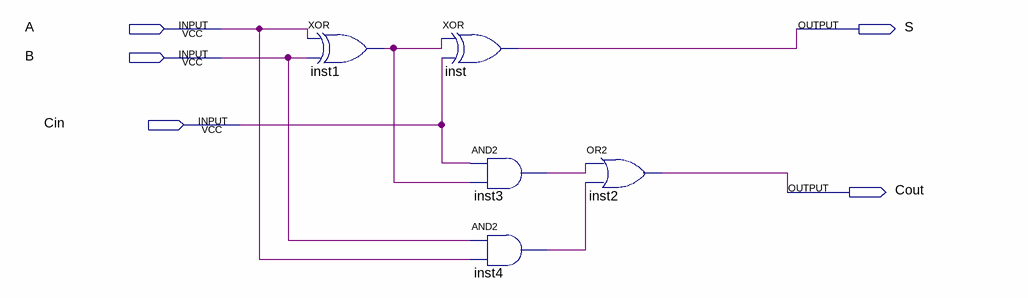
[diagram p0: schematic sheet]
// Quartus schematic Ad1.bdf as structural Verilog: 5 symbols, 5 pins
module Ad1 (
  input  A,
  input  B,
  input  Cin,
  output S,
  output Cout
);

  wire inst1_out, inst3_out, inst4_out;

  xor inst1 (inst1_out, A, B);
  xor inst (S, inst1_out, Cin);
  and inst3 (inst3_out, Cin, inst1_out);
  and inst4 (inst4_out, B, A);
  or inst2 (Cout, inst3_out, inst4_out);
endmodule
